# Altium project Common_AMC_Box.PrjPcb (part 1 of 6)
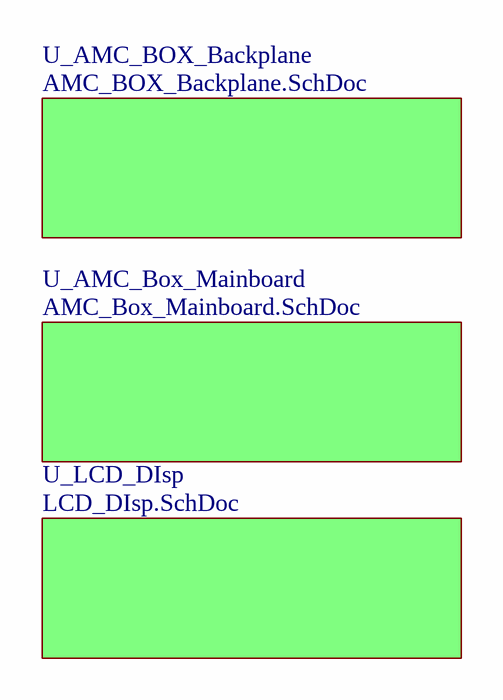
[diagram p0: Common_AMC_Box.SchDoc]
18 sheets, 545 parts. Net scope: flat (ports and power ports of the same name join across sheets).
Board file: Common_AMC_Box.PcbDoc
Sheets:
  Common_AMC_Box.SchDoc
    U_AMC_BOX_Backplane = AMC_BOX_Backplane.SchDoc
      AFC = AMC.SchDoc
    U_AMC_Box_Mainboard = AMC_Box_Mainboard.SchDoc
      U_Supply = Supply.SchDoc
      U_clocking = clocking.SchDoc
      U_IO = IO.SchDoc
      U_IO = IO.SchDoc
      U_SFP = SFP.SchDoc
      U_SFP = SFP.SchDoc
      U_I2C_SW = I2C_SW.SchDoc
      Thermal_MGT = Thermal_MGT.SchDoc
      U_CPU = CPU_ETH.SchDoc
      U_LCD = LCD.SchDoc
      U_USB_Hub_AMCbox = USB_Hub_AMCbox.SchDoc
      U_USB_UART = USB_UART.SchDoc
      U_JTAG_AMC_Box = JTAG_AMC_Box.SchDoc
      U_USB_I2C_Bridge = USB_I2C_Bridge.SchDoc
      U_QSFP0 = QSFP.SchDoc
      U_QSFP1 = QSFP.SchDoc
      U_QSFP2 = QSFP.SchDoc
    U_LCD_DIsp = LCD_DIsp.SchDoc

## Sheet Common_AMC_Box.SchDoc: Title
size 420 x 297 mm; Author: G.Kasprowicz; CompanyName: WUT ISE; DrawnBy: G.Kasprowicz; Organization: WUT ISE; Address1: PW ISE; Address2: Nowowiejska 15/19 00-665 Warsaw; Address3: gkasprow@gmail.com; DocumentNumber: 1; Revision: 2; SheetNumber: 1; SheetTotal: 18; ModifiedBy: -; CheckedDate: -; Title2: Title 2; DivGrp: WUT ISE; Designer: G.Kasprowicz; ModifiedDate: -; ProjectName: Sensor Box

### Sub-sheets
U_AMC_BOX_Backplane = AMC_BOX_Backplane.SchDoc: no entries
U_AMC_Box_Mainboard = AMC_Box_Mainboard.SchDoc: no entries
U_LCD_DIsp = LCD_DIsp.SchDoc: no entries

### Notes on the sheet
- Project/Equipment
- Document
- Designer
- Drawn by
- Check.by
- Copyright WUT ISE 2020.
  This documentation describes Open Hardware and is licensed under the CERN OHL v.1.2. You may redistribute and modify this documentation under the terms of the CERN OHL v.1.2. (http://ohwr.org/CERNOHL). This documentation is distributed WITHOUT ANY EXPRESS OR IMPLIED WARRANTY, INCLUDING OF MERCHANTABILITY, SATISFACTORY QUALITY AND FITNESS FOR A PARTICULAR PURPOSE. Please see the CERN OHL v.1.2 for applicable conditions.
- Contact
- File
- Last Mod.
- Print Date
- Sheet
- Size
- A3
- of
- Rev

## Sheet AMC_BOX_Backplane.SchDoc: Title
size 420 x 297 mm; Author: G.Kasprowicz; CompanyName: WUT ISE; DrawnBy: G.Kasprowicz; Organization: WUT ISE; Address1: PW ISE; Address2: Nowowiejska 15/19 00-665 Warsaw; Address3: gkasprow@gmail.com; DocumentNumber: 16; Revision: 2; SheetNumber: 16; SheetTotal: 18; ModifiedBy: -; CheckedDate: -; Title2: Title 2; DivGrp: WUT ISE; Designer: G.Kasprowicz; ModifiedDate: -; ProjectName: Sensor Box
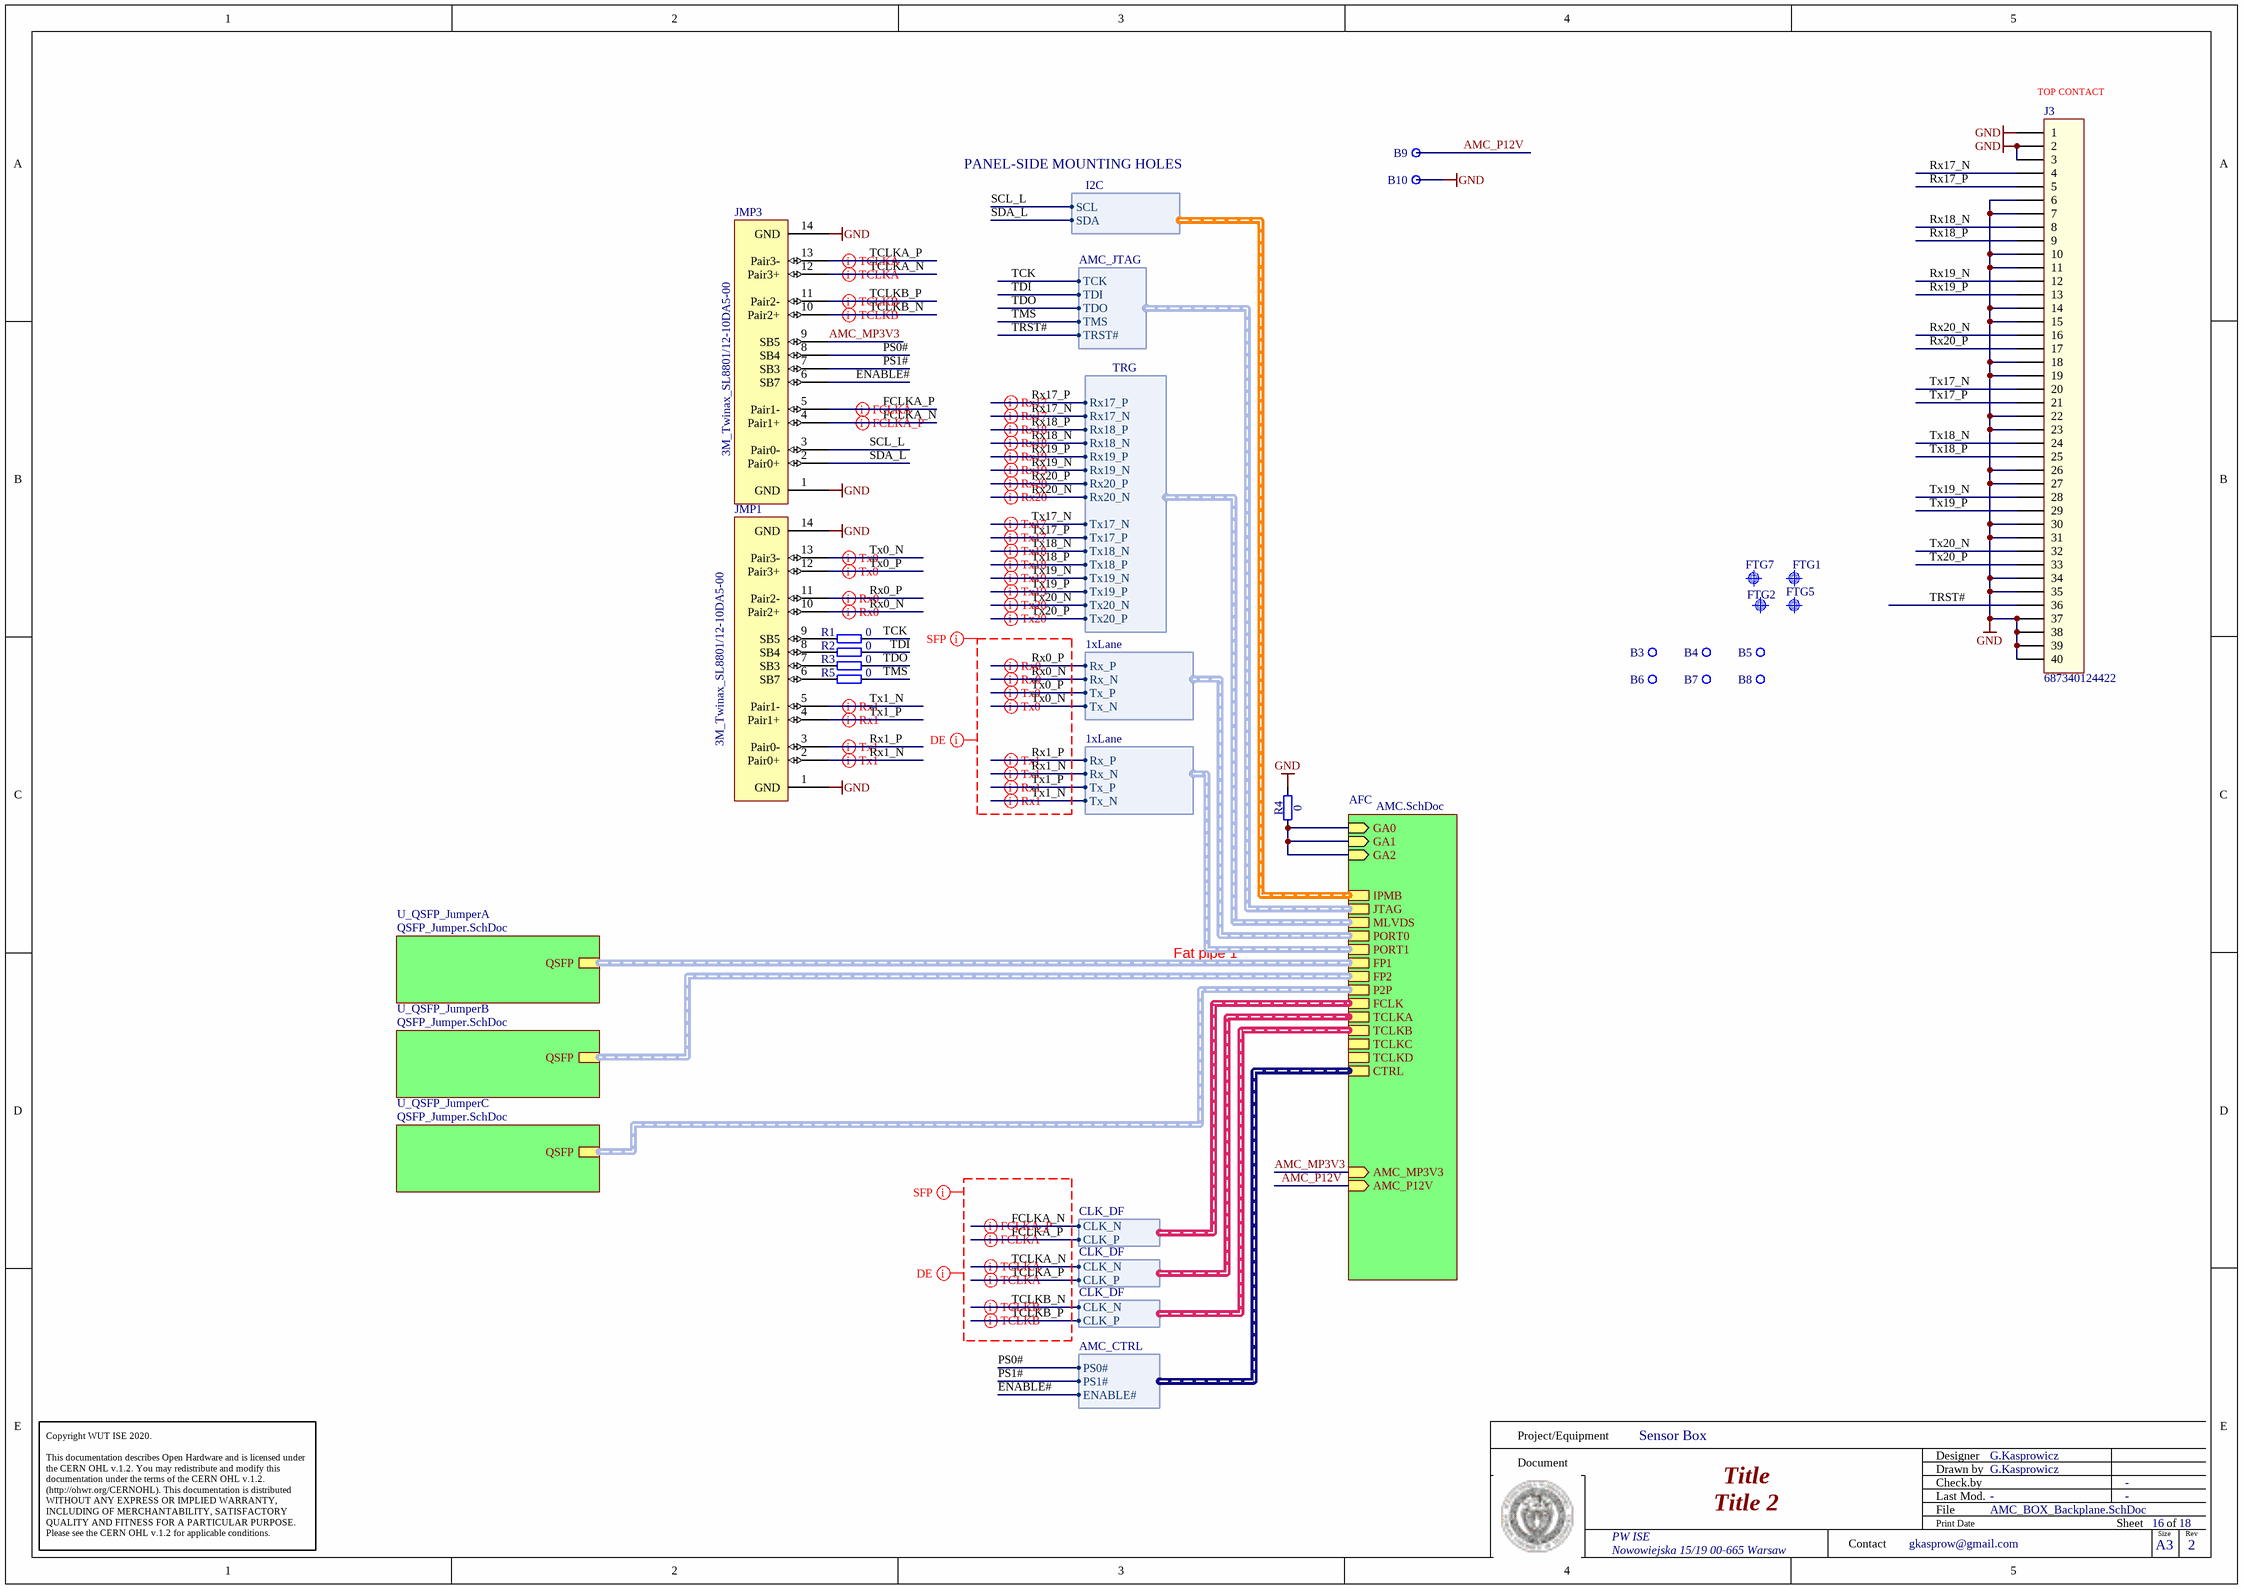
[diagram p1: AMC_BOX_Backplane.SchDoc]

### Parts
(Parts that share a designator on the sheet are numbered #1, #2 ... from top to bottom, then left to right.)
B3  Plated Hole  [MTG320_550]  (value not drawn)
B4  Plated Hole  [MTG320_550]  (value not drawn)
B5  Plated Hole  [MTG320_550]  (value not drawn)
B6  Plated Hole  [MTG320_550]  (value not drawn)
B7  Plated Hole  [MTG320_550]  (value not drawn)
B8  Plated Hole  [MTG320_550]  (value not drawn)
B9  Plated Hole  [c200h150]  (value not drawn)
B10  Plated Hole  [c200h150]  (value not drawn)
FTG1  Use only in PCB  [FIDUCIAL_TOP_S100-200]  (value not drawn)
FTG2  Use only in PCB  [FIDUCIAL_TOP_S100-200]  (value not drawn)
FTG5  Use only in PCB  [FIDUCIAL_TOP_S100-200]  (value not drawn)
FTG7  Use only in PCB  [FIDUCIAL_TOP_S100-200]  (value not drawn)
J3  687340124422  [687340124422]
JMP1  3M_Twinax_SL8801/12-10DA5-00  [3M_Twinax_SL8801/12-10DA5-00]
JMP3  3M_Twinax_SL8801/12-10DA5-00  [3M_Twinax_SL8801/12-10DA5-00]
R1#1  0  [RESC1005X40N]
R2#1  0  [RESC1005X40N]
R3#1  0  [RESC1005X40N]
R4#1  0  [RESC1005X40N]
R5#1  0  [RESC1005X40N]

### Sub-sheets
AFC = AMC.SchDoc: GA0 (in), GA1 (in), GA2 (in), MLVDS (harness TRG), PORT0 (harness 1xLane), FP2 (harness FP), PORT1 (harness 1xLane), FCLK (harness CLK_DF), TCLKA (harness CLK_DF), TCLKB (harness CLK_DF), TCLKC (harness CLK_DF), TCLKD (harness CLK_DF), FP1 (harness QSFP), AMC_P12V (in), AMC_MP3V3 (in), IPMB (harness I2C), CTRL (harness AMC_CTRL), P2P (harness FP), JTAG (harness AMC_JTAG)
U_QSFP_JumperA = QSFP_Jumper.SchDoc (file not in this document): QSFP (harness QSFP)
U_QSFP_JumperB = QSFP_Jumper.SchDoc (file not in this document): QSFP (harness QSFP)
U_QSFP_JumperC = QSFP_Jumper.SchDoc (file not in this document): QSFP (harness QSFP)

### Harnesses
I2C: SCL, SDA
1xLane: Rx_P, Rx_N, Tx_P, Tx_N
CLK_DF: CLK_P, CLK_N
AMC_CTRL: PS0#, PS1#, ENABLE#
TRG: Rx17_P, Rx17_N, Rx18_P, Rx18_N, Rx19_P, Rx19_N, Rx20_P, Rx20_N, Tx17_N, Tx17_P, Tx18_N, Tx18_P, Tx19_N, Tx19_P, Tx20_N, Tx20_P
AMC_JTAG: TCK, TDI, TDO, TMS, TRST#

### Nets
GND: B10.1 J3.1 J3.2 J3.3 J3.6 J3.7 J3.10 J3.11 J3.14 J3.15 J3.18 J3.19 J3.22 J3.23 J3.26 J3.27 J3.30 J3.31 J3.34 J3.35 J3.37 J3.38 J3.39 J3.40 JMP1.1(GND) JMP1.14(GND) JMP3.1(GND) JMP3.14(GND) R4#1.2
AMC_MP3V3: JMP3.9(SB5) ; sheet AFC/AMC_MP3V3
AMC_P12V: B9.1 ; sheet AFC/AMC_P12V
ENABLE#: JMP3.6(SB7) ; sheet AFC/CTRL.ENABLE#
FCLKA_N: JMP3.4(Pair1+) ; sheet AFC/FCLK.CLK_N
FCLKA_P: JMP3.5(Pair1-) ; sheet AFC/FCLK.CLK_P
PS0#: JMP3.8(SB4) ; sheet AFC/CTRL.PS0#
PS1#: JMP3.7(SB3) ; sheet AFC/CTRL.PS1#
Rx0_N: JMP1.10(Pair2+) ; sheet AFC/PORT0.Rx_N
Rx0_P: JMP1.11(Pair2-) ; sheet AFC/PORT0.Rx_P
Rx1_N: JMP1.2(Pair0+) ; sheet AFC/PORT1.Rx_N
Rx1_P: JMP1.3(Pair0-) ; sheet AFC/PORT1.Rx_P
Rx17_N: J3.4 ; sheet AFC/MLVDS.Rx17_N
Rx17_P: J3.5 ; sheet AFC/MLVDS.Rx17_P
Rx18_N: J3.8 ; sheet AFC/MLVDS.Rx18_N
Rx18_P: J3.9 ; sheet AFC/MLVDS.Rx18_P
Rx19_N: J3.12 ; sheet AFC/MLVDS.Rx19_N
Rx19_P: J3.13 ; sheet AFC/MLVDS.Rx19_P
Rx20_N: J3.16 ; sheet AFC/MLVDS.Rx20_N
Rx20_P: J3.17 ; sheet AFC/MLVDS.Rx20_P
SCL_L: JMP3.3(Pair0-) ; sheet AFC/IPMB.SCL
SDA_L: JMP3.2(Pair0+) ; sheet AFC/IPMB.SDA
TCK: R1#1.2 ; sheet AFC/JTAG.TCK
TCLKA_N: JMP3.12(Pair3+) ; sheet AFC/TCLKA.CLK_N
TCLKA_P: JMP3.13(Pair3-) ; sheet AFC/TCLKA.CLK_P
TCLKB_N: JMP3.10(Pair2+) ; sheet AFC/TCLKB.CLK_N
TCLKB_P: JMP3.11(Pair2-) ; sheet AFC/TCLKB.CLK_P
TDI: R2#1.2 ; sheet AFC/JTAG.TDI
TDO: R3#1.2 ; sheet AFC/JTAG.TDO
TMS: R5#1.2 ; sheet AFC/JTAG.TMS
TRST#: J3.36 ; sheet AFC/JTAG.TRST#
Tx0_N: JMP1.13(Pair3-) ; sheet AFC/PORT0.Tx_N
Tx0_P: JMP1.12(Pair3+) ; sheet AFC/PORT0.Tx_P
Tx1_N: JMP1.5(Pair1-) ; sheet AFC/PORT1.Tx_N
Tx1_P: JMP1.4(Pair1+) ; sheet AFC/PORT1.Tx_P
Tx17_N: J3.20 ; sheet AFC/MLVDS.Tx17_N
Tx17_P: J3.21 ; sheet AFC/MLVDS.Tx17_P
Tx18_N: J3.24 ; sheet AFC/MLVDS.Tx18_N
Tx18_P: J3.25 ; sheet AFC/MLVDS.Tx18_P
Tx19_N: J3.28 ; sheet AFC/MLVDS.Tx19_N
Tx19_P: J3.29 ; sheet AFC/MLVDS.Tx19_P
Tx20_N: J3.32 ; sheet AFC/MLVDS.Tx20_N
Tx20_P: J3.33 ; sheet AFC/MLVDS.Tx20_P
NetJMP1_6: JMP1.6(SB7) R5#1.1
NetJMP1_7: JMP1.7(SB3) R3#1.1
NetJMP1_8: JMP1.8(SB4) R2#1.1
NetJMP1_9: JMP1.9(SB5) R1#1.1
NetR4#1_1: R4#1.1 ; sheet AFC/GA0, sheet AFC/GA1, sheet AFC/GA2

Not connected (* = marked no-connect by the designer): B3 1; B4 1; B5 1; B6 1; B7 1; B8 1

### Buses and harness runs
harness sheet AFC/FP1 = sheet U_QSFP_JumperA/QSFP
harness sheet AFC/FP2 = sheet U_QSFP_JumperB/QSFP
harness sheet AFC/P2P = sheet U_QSFP_JumperC/QSFP

### Layout directives
differential pair: FCLKA_N, FCLKA_P, Rx0_N, Rx0_P, Rx1_N, Rx1_P, Rx17_N, Rx17_P, Rx18_N, Rx18_P, Rx19_N, Rx19_P, Rx20_N, Rx20_P, TCLKA_N, TCLKA_P, TCLKB_N, TCLKB_P, Tx0_N, Tx0_P, Tx1_N, Tx1_P, Tx17_N, Tx17_P, Tx18_N, Tx18_P, Tx19_N, Tx19_P, Tx20_N, Tx20_P
net class SFP: FCLKA_N, FCLKA_P, Rx0_N, Rx0_P, Rx1_N, Rx1_P, TCLKA_N, TCLKA_P, TCLKB_N, TCLKB_P, Tx0_N, Tx0_P, Tx1_N, Tx1_P
net class DE: FCLKA_N, FCLKA_P, Rx0_N, Rx0_P, Rx1_N, Rx1_P, TCLKA_N, TCLKA_P, TCLKB_N, TCLKB_P, Tx0_N, Tx0_P, Tx1_N, Tx1_P

### Notes on the sheet
- (near J3) TOP CONTACT
- PANEL-SIDE MOUNTING HOLES
- Fat pipe 1
- Project/Equipment
- Document
- Designer
- Drawn by
- Check.by
- Copyright WUT ISE 2020.
  This documentation describes Open Hardware and is licensed under the CERN OHL v.1.2. You may redistribute and modify this documentation under the terms of the CERN OHL v.1.2. (http://ohwr.org/CERNOHL). This documentation is distributed WITHOUT ANY EXPRESS OR IMPLIED WARRANTY, INCLUDING OF MERCHANTABILITY, SATISFACTORY QUALITY AND FITNESS FOR A PARTICULAR PURPOSE. Please see the CERN OHL v.1.2 for applicable conditions.
- Contact
- File
- Last Mod.
- Print Date
- Sheet
- Size
- A3
- of
- Rev

### Library data of the parts
B3-B8 = PLATED_HOLE3.2_PAD5.5: Single Terminal Socket; Part Description: Plated Through Hole: Hole Dia.=3.2mm Pad Dia.=5.5mm; Mounted: No; Part Number: PLATED_HOLE3.2_PAD5.5; Component Kind: Standard (No BOM); Component Type: Standard (No BOM); Pin Count: 1; Family: Plated Hole; Socket: No; SMD: No; Sense: No; Status: None; ComponentHeight: 0mm; HelpURL: Undefined; Author: CERN DEM JMW; CreateDate: 01.10.2012; LatestRevisionDate: 01.10.2012; PackageDescription: Plated Through Hole: Hole Dia.=3.2mm Pad Dia.=5.5mm
B9 B10 = PLATED_HOLE1.5_PAD2.0: Single Terminal Socket; Part Description: Plated Through Hole: Hole Dia.=1.5mm Pad Dia.=2.0mm, IPC-7251 Level C; Mounted: No; Part Number: PLATED_HOLE1.5_PAD2.0; Component Kind: Standard (No BOM); Component Type: Standard (No BOM); Pin Count: 1; Family: Plated Hole; Socket: No; SMD: No; Sense: No; Status: None; ComponentHeight: 0mm; HelpURL: Undefined; Author: CERN DEM JLC; CreateDate: 30.10.2008; LatestRevisionDate: 30.10.2008; PackageDescription: Plated Through Hole: Hole Dia.=1.5mm Pad Dia.=2.0mm, IPC-7251 Level C
FTG1 FTG2 FTG5 FTG7 = FIDUCIAL_TARGET_S100-200: Fiducial Target; Part Description: Square Fiducial Target, Top Layer, 1.0mm, Top Solder 2.0mm, Keepout =2.0mm; Mounted: No; Table: Pads; Part Number: FIDUCIAL_TARGET_S100-200; Component Kind: Standard (No BOM); Component Type: Standard (No BOM); Pin Count: 1; Family: Fiducial; Socket: No; SMD: Yes; Status: None; ComponentHeight: 0mm; Author: CERN DEM JLC; CreateDate: 2010-02-09; LatestRevisionDate: 2012-04-04; PackageDescription: Square Fiducial Target, Top Layer, 1.0mm, Top Solder 2.0mm, Keepout =2.0mm
J3 = 687340124422: 0.50 mm SMT ZIF Vertical WR-FPC, 40 pins; Pitch: 0.5 mm; Pin Number: 40; ComponentLink1Description: Manufacturer; ComponentLink1URL: http://www.we-online.de; ComponentLink2Description: Datasheet; ComponentLink2URL: http://katalog.we-online.com/em/datasheet/6873xx124422.pdf; Part Number: 687340124422; Published Date: April 2017; Publisher: Wurth Elektronik
JMP1 JMP3 = CBL_TWINAX_3M_4pairs_SB: Flat Ribbon Cable Silver 8 (4 Pair) Conductors 0.093" (2.37mm) Between Pairs Flat Twin Axial 500.0' (152.40m)
R1#1 R2#1 R3#1 R4#1 R5#1 = R0402_0R_JUMPER: Resistor; Part Description: 1A (0.05R Max DC Resistance) Zero Ohm Jumper; Manufacturer: GENERIC; Manufacturer1 Part Number: 232270591001L; Table: Resistors SMD; Part Number: R0402_0R_JUMPER; Component Kind: Standard; Component Type: Standard; Pin Count: 2; Value: 0; Status: Not recommended; Manufacturer Part Number: R0402_0R_JUMPER; Case: 0402; Mounted: Yes; Socket: No; SMD: Yes; Manufacturer1 Example: YAGEO PHYCOMP; Manufacturer1 ComponentHeight: 0.4mm; HelpURL: \\cern.ch\dfs\Applications\Altium\Datasheets\R0402_Phycomp_RC0402.pdf; Author: CERN DEM JLC; CreateDate: 2007-12-03; LatestRevisionDate: 2012-10-17

## Sheet AMC.SchDoc: Title
size 420 x 297 mm; Author: G.Kasprowicz; CompanyName: WUT ISE; DrawnBy: G.Kasprowicz; Organization: WUT ISE; Address1: PW ISE; Address2: Nowowiejska 15/19 00-665 Warsaw; Address3: gkasprow@gmail.com; DocumentNumber: 17; Revision: 2; SheetNumber: 17; SheetTotal: 18; ModifiedBy: -; CheckedDate: -; Title2: Title 2; DivGrp: WUT ISE; Designer: G.Kasprowicz; ModifiedDate: -; ProjectName: Sensor Box
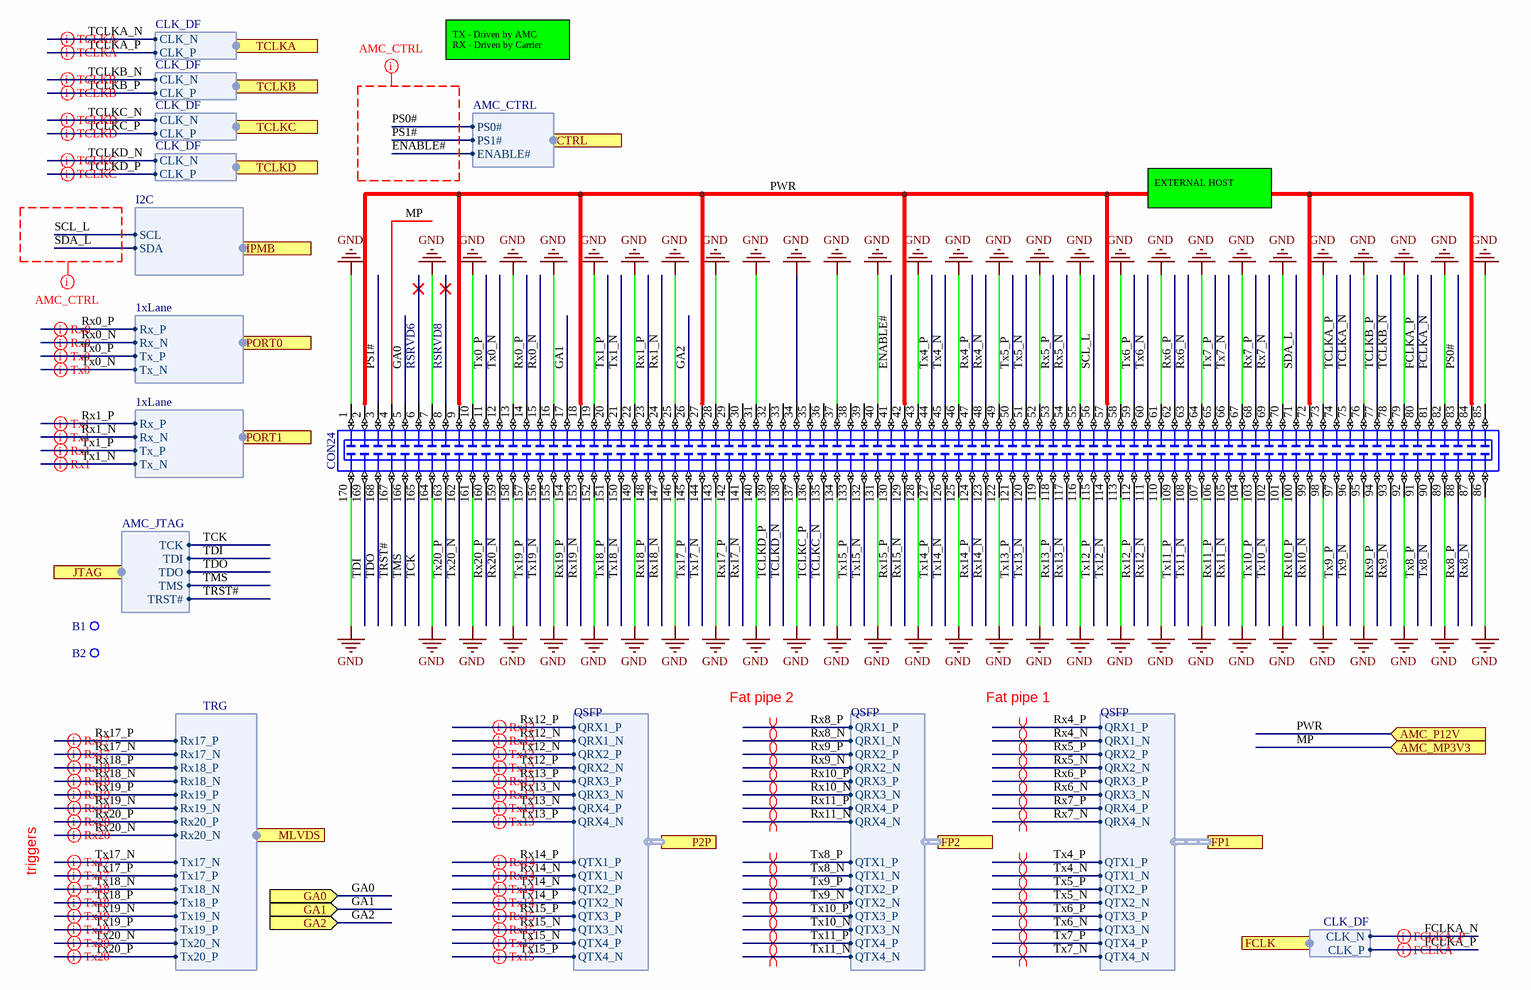
[diagram p2: AMC.SchDoc]

### Parts
B1  Plated Hole  [MTG320_550]  (value not drawn)
B2  Plated Hole  [MTG320_550]  (value not drawn)
CON24  SAMTEC_MTCA-085-02-S-DV-SMT-K-TR  [SAMTEC_MTCA-085-02-S-DV-SMT-K-TR]  (value not drawn)

### Ports
AMC_MP3V3 (in), AMC_P12V (in), CTRL (harness AMC_CTRL), FCLK (harness CLK_DF), FP1 (harness QSFP), FP2 (harness QSFP), GA0 (in), GA1 (in), GA2 (in), IPMB (harness I2C), JTAG (harness AMC_JTAG), MLVDS (harness TRG), P2P (harness QSFP), PORT0 (harness 1xLane), PORT1 (harness 1xLane), TCLKA (harness CLK_DF), TCLKB (harness CLK_DF), TCLKC (harness CLK_DF), TCLKD (harness CLK_DF)

### Harnesses
TRG: Rx17_P, Rx17_N, Rx18_P, Rx18_N, Rx19_P, Rx19_N, Rx20_P, Rx20_N, Tx17_N, Tx17_P, Tx18_N, Tx18_P, Tx19_N, Tx19_P, Tx20_N, Tx20_P
1xLane: Rx_P, Rx_N, Tx_P, Tx_N
I2C: SCL, SDA
CLK_DF: CLK_P, CLK_N
AMC_CTRL: PS0#, PS1#, ENABLE#
AMC_JTAG: TCK, TDI, TDO, TMS, TRST#
QSFP: QRX1_P, QRX1_N, QRX2_P, QRX2_N, QRX3_P, QRX3_N, QRX4_P, QRX4_N, QTX1_P, QTX1_N, QTX2_P, QTX2_N, QTX3_P, QTX3_N, QTX4_P, QTX4_N

### Nets
GND: CON24.1 CON24.7 CON24.10 CON24.13 CON24.16 CON24.19 CON24.22 CON24.25 CON24.28 CON24.31 CON24.34 CON24.37 CON24.40 CON24.43 CON24.46 CON24.49 CON24.52 CON24.55 CON24.58 CON24.61 CON24.64 CON24.67 CON24.70 CON24.73 CON24.76 CON24.79 CON24.82 CON24.85 CON24.86 CON24.89 CON24.92 CON24.95 CON24.98 CON24.101 CON24.104 CON24.107 CON24.110 CON24.113 CON24.116 CON24.119 CON24.122 CON24.125 CON24.128 CON24.131 CON24.134 CON24.137 CON24.140 CON24.143 CON24.146 CON24.149 CON24.152 CON24.155 CON24.158 CON24.161 CON24.164 CON24.170
ENABLE#: CON24.41 ; port CTRL.ENABLE#
FCLKA_N: CON24.81 ; port FCLK.CLK_N
FCLKA_P: CON24.80 ; port FCLK.CLK_P
GA0: CON24.5 ; port GA0
GA1: CON24.17 ; port GA1
GA2: CON24.26 ; port GA2
MP: CON24.4 ; port AMC_MP3V3
PS0#: CON24.83 ; port CTRL.PS0#
PS1#: CON24.3 ; port CTRL.PS1#
PWR: CON24.2 CON24.9 CON24.18 CON24.27 CON24.42 CON24.57 CON24.72 CON24.84 ; port AMC_P12V
Rx0_N: CON24.15 ; port PORT0.Rx_N
Rx0_P: CON24.14 ; port PORT0.Rx_P
Rx1_N: CON24.24 ; port PORT1.Rx_N
Rx1_P: CON24.23 ; port PORT1.Rx_P
Rx4_N: CON24.48 ; port FP1.QRX1_N
Rx4_P: CON24.47 ; port FP1.QRX1_P
Rx5_N: CON24.54 ; port FP1.QRX2_N
Rx5_P: CON24.53 ; port FP1.QRX2_P
Rx6_N: CON24.63 ; port FP1.QRX3_N
Rx6_P: CON24.62 ; port FP1.QRX3_P
Rx7_N: CON24.69 ; port FP1.QRX4_N
Rx7_P: CON24.68 ; port FP1.QRX4_P
Rx8_N: CON24.87 ; port FP2.QRX1_N
Rx8_P: CON24.88 ; port FP2.QRX1_P
Rx9_N: CON24.93 ; port FP2.QRX2_N
Rx9_P: CON24.94 ; port FP2.QRX2_P
Rx10_N: CON24.99 ; port FP2.QRX3_N
Rx10_P: CON24.100 ; port FP2.QRX3_P
Rx11_N: CON24.105 ; port FP2.QRX4_N
Rx11_P: CON24.106 ; port FP2.QRX4_P
Rx12_N: CON24.111 ; port P2P.QRX1_N
Rx12_P: CON24.112 ; port P2P.QRX1_P
Rx13_N: CON24.117 ; port P2P.QRX3_N
Rx13_P: CON24.118 ; port P2P.QRX3_P
Rx14_N: CON24.123 ; port P2P.QTX1_N
Rx14_P: CON24.124 ; port P2P.QTX1_P
Rx15_N: CON24.129 ; port P2P.QTX3_N
Rx15_P: CON24.130 ; port P2P.QTX3_P
Rx17_N: CON24.141 ; port MLVDS.Rx17_N
Rx17_P: CON24.142 ; port MLVDS.Rx17_P
Rx18_N: CON24.147 ; port MLVDS.Rx18_N
Rx18_P: CON24.148 ; port MLVDS.Rx18_P
Rx19_N: CON24.153 ; port MLVDS.Rx19_N
Rx19_P: CON24.154 ; port MLVDS.Rx19_P
Rx20_N: CON24.159 ; port MLVDS.Rx20_N
Rx20_P: CON24.160 ; port MLVDS.Rx20_P
SCL_L: CON24.56 ; port IPMB.SCL
SDA_L: CON24.71 ; port IPMB.SDA
TCK: CON24.165 ; port JTAG.TCK
TCLKA_N: CON24.75 ; port TCLKA.CLK_N
TCLKA_P: CON24.74 ; port TCLKA.CLK_P
TCLKB_N: CON24.78 ; port TCLKB.CLK_N
TCLKB_P: CON24.77 ; port TCLKB.CLK_P
TCLKC_N: CON24.135 ; port TCLKC.CLK_N
TCLKC_P: CON24.136 ; port TCLKC.CLK_P
TCLKD_N: CON24.138 ; port TCLKD.CLK_N
TCLKD_P: CON24.139 ; port TCLKD.CLK_P
TDI: CON24.169 ; port JTAG.TDI
TDO: CON24.168 ; port JTAG.TDO
TMS: CON24.166 ; port JTAG.TMS
TRST#: CON24.167 ; port JTAG.TRST#
Tx0_N: CON24.12 ; port PORT0.Tx_N
Tx0_P: CON24.11 ; port PORT0.Tx_P
Tx1_N: CON24.21 ; port PORT1.Tx_N
Tx1_P: CON24.20 ; port PORT1.Tx_P
Tx4_N: CON24.45 ; port FP1.QTX1_N
Tx4_P: CON24.44 ; port FP1.QTX1_P
Tx5_N: CON24.51 ; port FP1.QTX2_N
Tx5_P: CON24.50 ; port FP1.QTX2_P
Tx6_N: CON24.60 ; port FP1.QTX3_N
Tx6_P: CON24.59 ; port FP1.QTX3_P
Tx7_N: CON24.66 ; port FP1.QTX4_N
Tx7_P: CON24.65 ; port FP1.QTX4_P
Tx8_N: CON24.90 ; port FP2.QTX1_N
Tx8_P: CON24.91 ; port FP2.QTX1_P
Tx9_N: CON24.96 ; port FP2.QTX2_N
Tx9_P: CON24.97 ; port FP2.QTX2_P
Tx10_N: CON24.102 ; port FP2.QTX3_N
Tx10_P: CON24.103 ; port FP2.QTX3_P
Tx11_N: CON24.108 ; port FP2.QTX4_N
Tx11_P: CON24.109 ; port FP2.QTX4_P
Tx12_N: CON24.114 ; port P2P.QRX2_P
Tx12_P: CON24.115 ; port P2P.QRX2_N
Tx13_N: CON24.120 ; port P2P.QRX4_P
Tx13_P: CON24.121 ; port P2P.QRX4_N
Tx14_N: CON24.126 ; port P2P.QTX2_P
Tx14_P: CON24.127 ; port P2P.QTX2_N
Tx15_N: CON24.132 ; port P2P.QTX4_P
Tx15_P: CON24.133 ; port P2P.QTX4_N
Tx17_N: CON24.144 ; port MLVDS.Tx17_N
Tx17_P: CON24.145 ; port MLVDS.Tx17_P
Tx18_N: CON24.150 ; port MLVDS.Tx18_N
Tx18_P: CON24.151 ; port MLVDS.Tx18_P
Tx19_N: CON24.156 ; port MLVDS.Tx19_N
Tx19_P: CON24.157 ; port MLVDS.Tx19_P
Tx20_N: CON24.162 ; port MLVDS.Tx20_N
Tx20_P: CON24.163 ; port MLVDS.Tx20_P

Not connected (* = marked no-connect by the designer): B1 1; B2 1; CON24 6* 8* 29 30 32 33 35 36 38 39

### Layout directives
differential pair: FCLKA_N, FCLKA_P, Rx0_N, Rx0_P, Rx1_N, Rx1_P, Rx4_N, Rx4_P, Rx5_N, Rx5_P, Rx6_N, Rx6_P, Rx7_N, Rx7_P, Rx8_N, Rx8_P, Rx9_N, Rx9_P, Rx10_N, Rx10_P, Rx11_N, Rx11_P, Rx12_N, Rx12_P, Rx13_N, Rx13_P, Rx14_N, Rx14_P, Rx15_N, Rx15_P, Rx17_N, Rx17_P, Rx18_N, Rx18_P, Rx19_N, Rx19_P, Rx20_N, Rx20_P, TCLKA_N, TCLKA_P, TCLKB_N, TCLKB_P, TCLKC_N, TCLKC_P, TCLKD_N, TCLKD_P, Tx0_N, Tx0_P, Tx1_N, Tx1_P, Tx4_N, Tx4_P, Tx5_N, Tx5_P, Tx6_N, Tx6_P, Tx7_N, Tx7_P, Tx8_N, Tx8_P, Tx9_N, Tx9_P, Tx10_N, Tx10_P, Tx11_N, Tx11_P, Tx12_N, Tx12_P, Tx13_N, Tx13_P, Tx14_N, Tx14_P, Tx15_N, Tx15_P, Tx17_N, Tx17_P, Tx18_N, Tx18_P, Tx19_N, Tx19_P, Tx20_N, Tx20_P
net class AMC_CTRL: ENABLE#, PS0#, PS1#, SCL_L, SDA_L

### Notes on the sheet
- TX - Driven by AMC
  RX - Driven by Carrier
- EXTERNAL HOST
- RSRVD6
- RSRVD8
- Fat pipe 2
- Fat pipe 1
- triggers
- Project/Equipment
- Document
- Designer
- Drawn by
- Check.by
- Copyright WUT ISE 2020.
  This documentation describes Open Hardware and is licensed under the CERN OHL v.1.2. You may redistribute and modify this documentation under the terms of the CERN OHL v.1.2. (http://ohwr.org/CERNOHL). This documentation is distributed WITHOUT ANY EXPRESS OR IMPLIED WARRANTY, INCLUDING OF MERCHANTABILITY, SATISFACTORY QUALITY AND FITNESS FOR A PARTICULAR PURPOSE. Please see the CERN OHL v.1.2 for applicable conditions.
- Contact
- File
- Last Mod.
- Print Date
- Sheet
- Size
- A3
- of
- Rev

### Library data of the parts
B1 B2 = PLATED_HOLE3.2_PAD5.5: as B3 on sheet AMC_BOX_Backplane; Part Number: PLATED_HOLE3.2_PAD5.5; Component Kind: Standard (No BOM); Component Type: Standard (No BOM); Pin Count: 1; Family: Plated Hole; Socket: No; SMD: No; Sense: No; Status: None; ComponentHeight: 0mm; HelpURL: Undefined; Author: CERN DEM JMW; CreateDate: 01.10.2012; LatestRevisionDate: 01.10.2012; PackageDescription: Plated Through Hole: Hole Dia.=3.2mm Pad Dia.=5.5mm
CON24 = SAMTEC_MTCA-085-02-S-DV-SMT-K-TR: 170 Poles,  Micro TCA (Telecom Computing Architecture) Edge Card Socket; Part Description: 170 Poles, Pitch 0.75mm, Micro TCA (Telecom Computing Architecture) Edge Card Socket; Manufacturer: SAMTEC; Part Number: SAMTEC_MTCA-085-02-S-DV-SMT-K-TR; Component Kind: Standard; Component Type: Standard; Pin Count: 170; Mounted: Yes; Socket: No; SMD: Yes; Status: None; Manufacturer Part Number: MTCA-085-02-S-DV-SMT-K-TR; ComponentHeight: 12.85mm; HelpURL: \\cern.ch\dfs\Applications\Altium\Datasheets\SAMTEC_MTCA-085-02-S-DV-SMT-K-TR.pdf; Author: CERN DEM JLC; CreateDate: 2012-08-15; LatestRevisionDate: 2012-08-15; Table: SAMTEC

## Sheet AMC_Box_Mainboard.SchDoc: AMC Box
size 420 x 297 mm; Author: G.Kasprowicz; CompanyName: WUT ISE; DrawnBy: G.Kasprowicz; Organization: WUT ISE; Address1: PW ISE; Address2: Nowowiejska 15/19 00-665 Warsaw; Address3: gkasprow@gmail.com; DocumentNumber: 2; Revision: 2; SheetNumber: 2; SheetTotal: 18; ModifiedBy: -; CheckedDate: -; Title2: Title 2; DivGrp: WUT ISE; Designer: G.Kasprowicz; ModifiedDate: -; ProjectName: Sensor Box
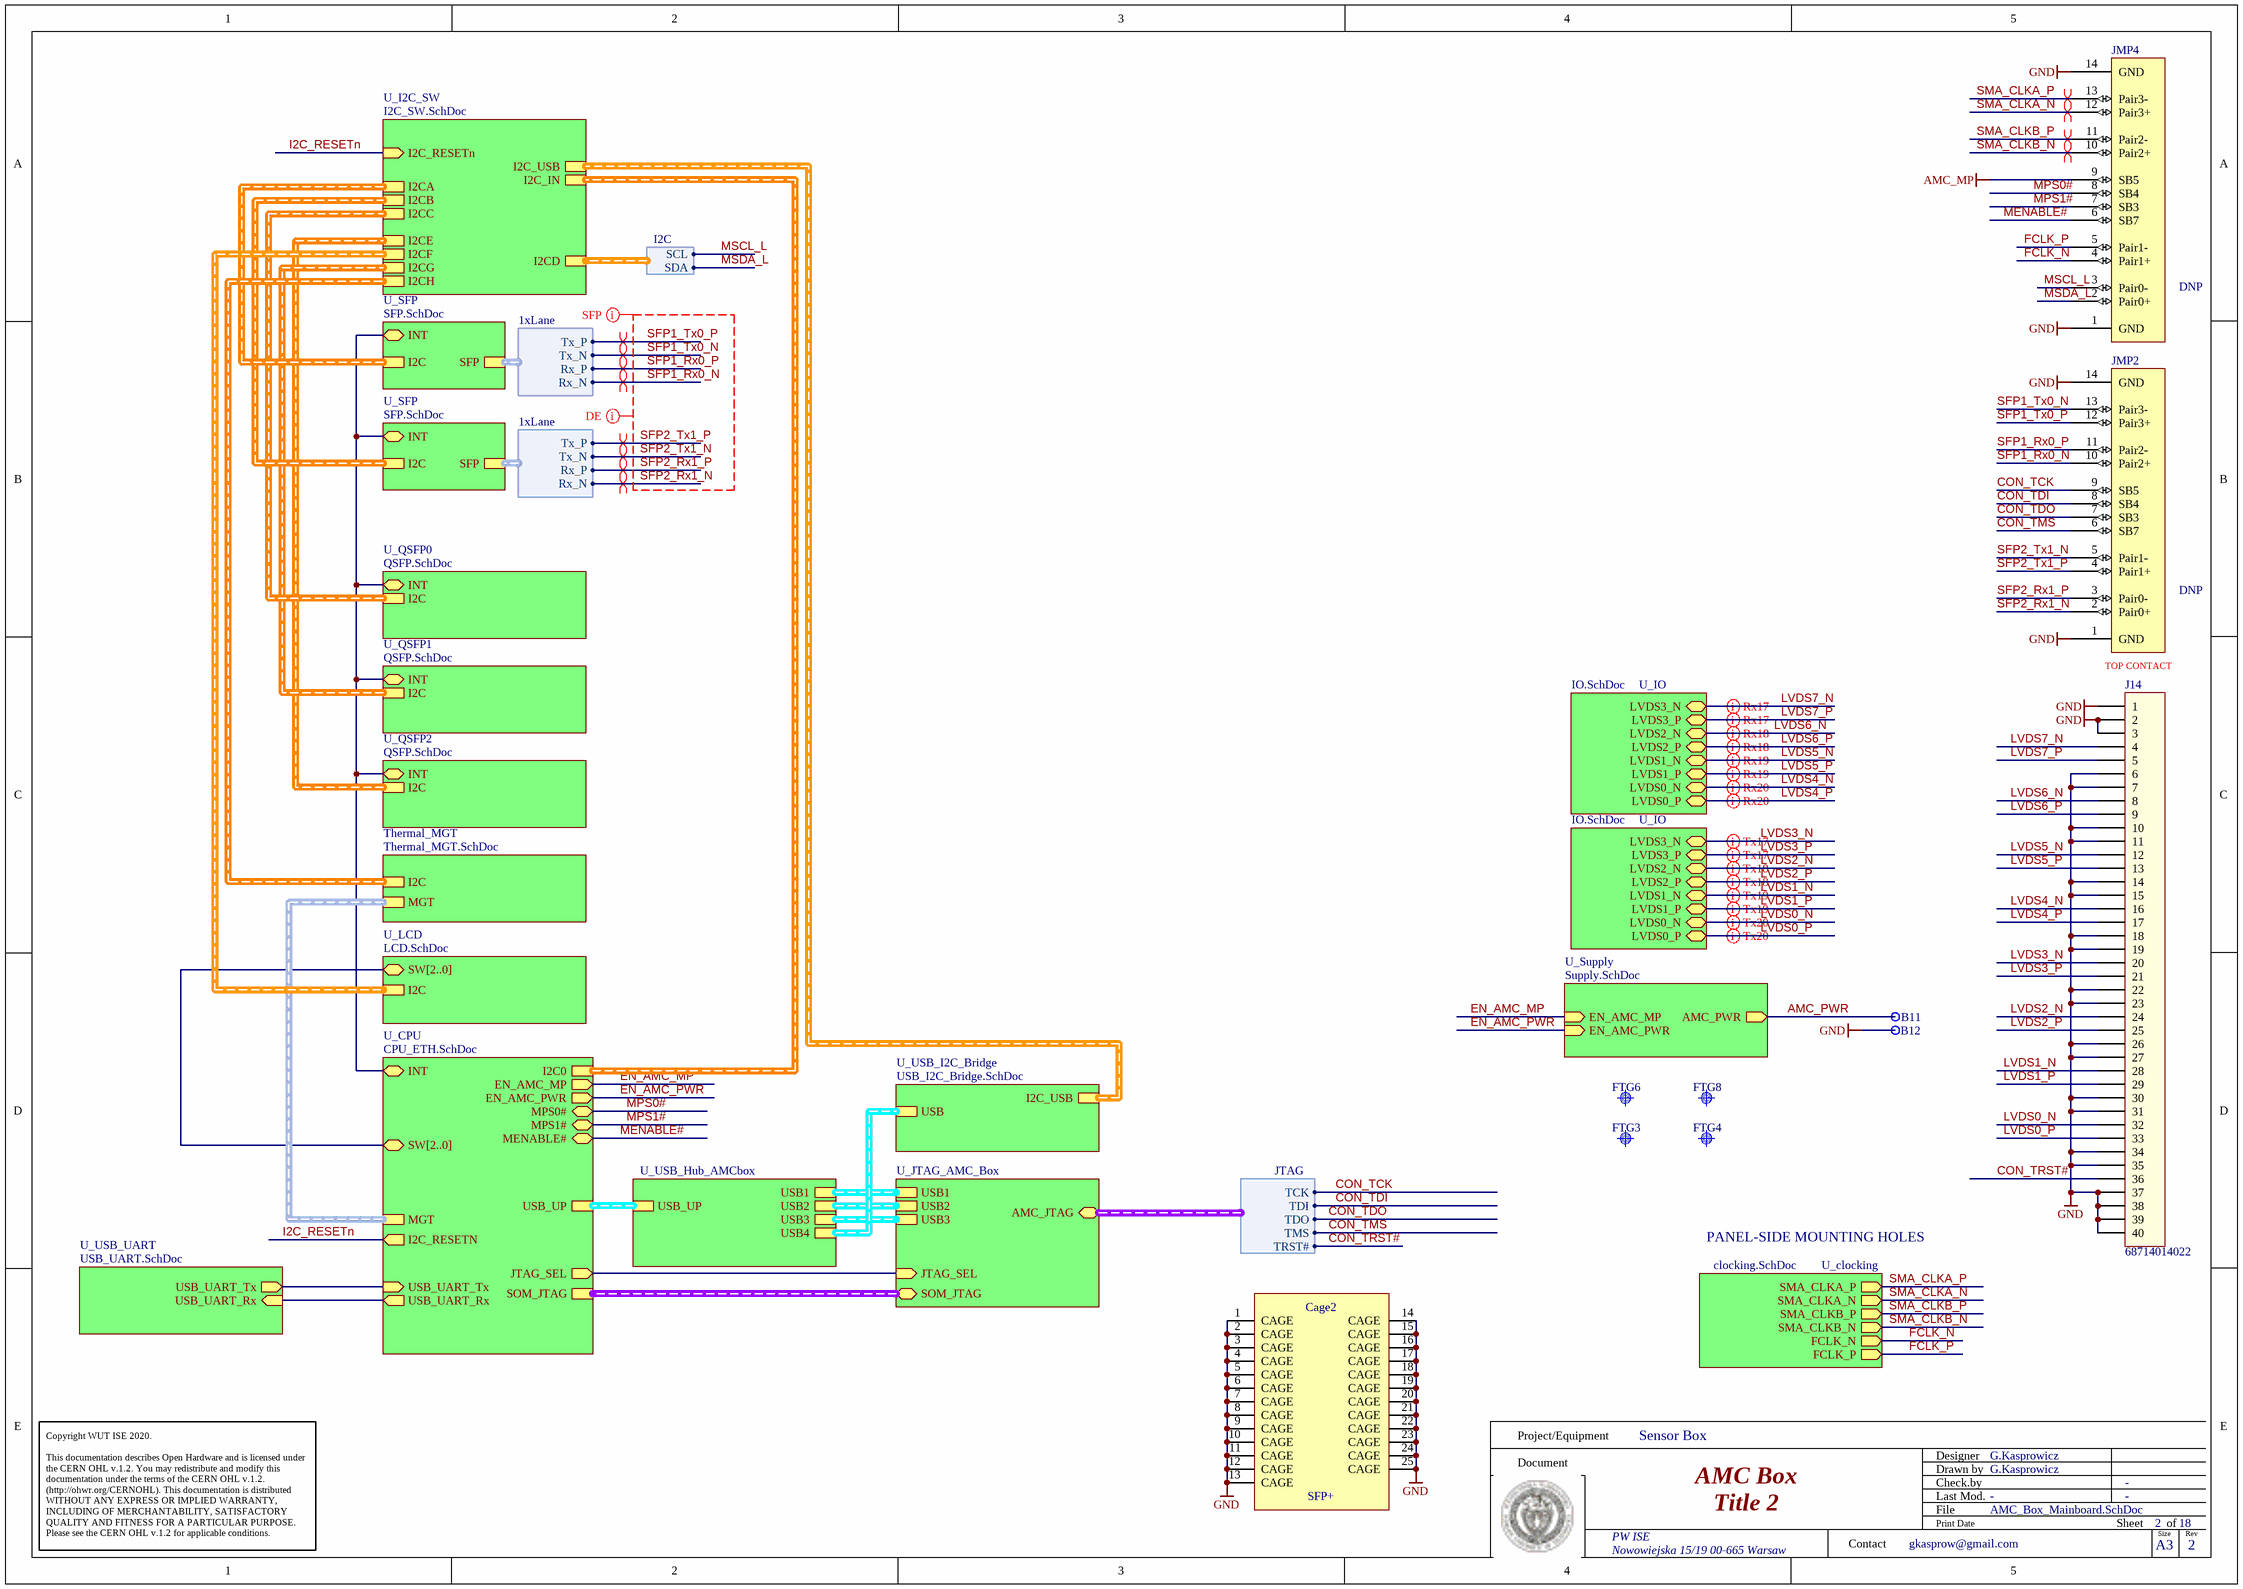
[diagram p3: AMC_Box_Mainboard.SchDoc]

### Parts
B11  Plated Hole  [c200h150]  (value not drawn)
B12  Plated Hole  [c200h150]  (value not drawn)
Cage2  SFP+  [TYCO_2007263-1]
FTG3  Use only in PCB  [FIDUCIAL_TOP_S100-200]  (value not drawn)
FTG4  Use only in PCB  [FIDUCIAL_TOP_C100-200]  (value not drawn)
FTG6  Use only in PCB  [FIDUCIAL_TOP_S100-200]  (value not drawn)
FTG8  Use only in PCB  [FIDUCIAL_TOP_C100-200]  (value not drawn)
J14  68714014022  [68714014022]
JMP2  DNP  [3M_Twinax_SL8801/12-10DA5-00]
JMP4  DNP  [3M_Twinax_SL8801/12-10DA5-00]

### Sub-sheets
Thermal_MGT = Thermal_MGT.SchDoc: I2C (harness I2C), MGT (harness THERM_MGT)
U_clocking = clocking.SchDoc: SMA_CLKA_P (out), SMA_CLKA_N (out), SMA_CLKB_P (out), SMA_CLKB_N (out), FCLK_N (out), FCLK_P (out)
U_CPU = CPU_ETH.SchDoc: I2C0 (harness I2C), MGT (harness THERM_MGT), EN_AMC_MP (out), EN_AMC_PWR (out), MPS0# (bidir), MPS1# (bidir), MENABLE# (bidir), SW[2..0] (bidir), I2C_RESETN (out), USB_UP (harness USB), USB_UART_Tx (in), USB_UART_Rx (out), SOM_JTAG (harness JTAG), JTAG_SEL (out), INT (bidir)
U_I2C_SW = I2C_SW.SchDoc: I2C_RESETn (in), I2CE (harness I2C), I2CB (harness I2C), I2CA (harness I2C), I2CD (harness I2C), I2CC (harness I2C), I2CG (harness I2C), I2CF (harness I2C), I2CH (harness I2C), I2C_IN (harness I2C), I2C_USB
U_IO = IO.SchDoc: LVDS3_N (bidir), LVDS3_P (bidir), LVDS2_N (bidir), LVDS2_P (bidir), LVDS1_N (bidir), LVDS1_P (bidir), LVDS0_N (bidir), LVDS0_P (bidir)
U_IO = IO.SchDoc: LVDS3_N (bidir), LVDS3_P (bidir), LVDS2_N (bidir), LVDS2_P (bidir), LVDS1_N (bidir), LVDS1_P (bidir), LVDS0_N (bidir), LVDS0_P (bidir)
U_JTAG_AMC_Box = JTAG_AMC_Box.SchDoc: AMC_JTAG (bidir, harness JTAG), SOM_JTAG (bidir, harness JTAG), USB1 (harness USB), USB2 (harness USB), USB3 (harness USB), JTAG_SEL (in)
U_LCD = LCD.SchDoc: I2C, SW[2..0] (bidir)
U_QSFP0 = QSFP.SchDoc: I2C (harness I2C), INT (bidir)
U_QSFP1 = QSFP.SchDoc: I2C (harness I2C), INT (bidir)
U_QSFP2 = QSFP.SchDoc: I2C (harness I2C), INT (bidir)
U_SFP = SFP.SchDoc: I2C (harness I2C), SFP (harness 1xLane), INT (bidir)
U_SFP = SFP.SchDoc: I2C (harness I2C), SFP (harness 1xLane), INT (bidir)
U_Supply = Supply.SchDoc: AMC_PWR (out), EN_AMC_MP (in), EN_AMC_PWR (in)
U_USB_Hub_AMCbox = USB_Hub_AMCbox.SchDoc: USB1 (harness USB), USB2 (harness USB), USB3 (harness USB), USB4 (harness USB), USB_UP (harness USB)
U_USB_I2C_Bridge = USB_I2C_Bridge.SchDoc: I2C_USB (harness I2C), USB (harness USB)
U_USB_UART = USB_UART.SchDoc: USB_UART_Rx (in), USB_UART_Tx (out)

### Harnesses
1xLane: Rx_P, Rx_N, Tx_P, Tx_N
I2C: SCL, SDA
JTAG: TCK, TMS, TDI, TDO, TRST#

### Nets
AMC_MP: JMP4.9(SB5)
GND: B12.1 Cage2.1(CAGE) Cage2.2(CAGE) Cage2.3(CAGE) Cage2.4(CAGE) Cage2.5(CAGE) Cage2.6(CAGE) Cage2.7(CAGE) Cage2.8(CAGE) Cage2.9(CAGE) Cage2.10(CAGE) Cage2.11(CAGE) Cage2.12(CAGE) Cage2.13(CAGE) Cage2.14(CAGE) Cage2.15(CAGE) Cage2.16(CAGE) Cage2.17(CAGE) Cage2.18(CAGE) Cage2.19(CAGE) Cage2.20(CAGE) Cage2.21(CAGE) Cage2.22(CAGE) Cage2.23(CAGE) Cage2.24(CAGE) Cage2.25(CAGE) J14.1 J14.2 J14.3 J14.6 J14.7 J14.10 J14.11 J14.14 J14.15 J14.18 J14.19 J14.22 J14.23 J14.26 J14.27 J14.30 J14.31 J14.34 J14.35 J14.37 J14.38 J14.39 J14.40 JMP2.1(GND) JMP2.14(GND) JMP4.1(GND) JMP4.14(GND)
AMC_PWR: B11.1 ; sheet U_Supply/AMC_PWR
CON_TCK: JMP2.9(SB5) ; sheet U_JTAG_AMC_Box/AMC_JTAG.TCK
CON_TDI: JMP2.8(SB4) ; sheet U_JTAG_AMC_Box/AMC_JTAG.TDI
CON_TDO: JMP2.7(SB3) ; sheet U_JTAG_AMC_Box/AMC_JTAG.TDO
CON_TMS: JMP2.6(SB7) ; sheet U_JTAG_AMC_Box/AMC_JTAG.TMS
CON_TRST#: J14.36 ; sheet U_JTAG_AMC_Box/AMC_JTAG.TRST#
EN_AMC_MP: sheet U_Supply/EN_AMC_MP, sheet U_CPU/EN_AMC_MP
EN_AMC_PWR: sheet U_Supply/EN_AMC_PWR, sheet U_CPU/EN_AMC_PWR
FCLK_N: JMP4.4(Pair1+) ; sheet U_clocking/FCLK_N
FCLK_P: JMP4.5(Pair1-) ; sheet U_clocking/FCLK_P
I2C_RESETn: sheet U_I2C_SW/I2C_RESETn, sheet U_CPU/I2C_RESETN
LVDS0_N: J14.32 ; sheet U_IO/LVDS0_N
LVDS0_P: J14.33 ; sheet U_IO/LVDS0_P
LVDS1_N: J14.28 ; sheet U_IO/LVDS1_N
LVDS1_P: J14.29 ; sheet U_IO/LVDS1_P
LVDS2_N: J14.24 ; sheet U_IO/LVDS2_N
LVDS2_P: J14.25 ; sheet U_IO/LVDS2_P
LVDS3_N: J14.20 ; sheet U_IO/LVDS3_N
LVDS3_P: J14.21 ; sheet U_IO/LVDS3_P
LVDS4_N: J14.16 ; sheet U_IO/LVDS0_N
LVDS4_P: J14.17 ; sheet U_IO/LVDS0_P
LVDS5_N: J14.12 ; sheet U_IO/LVDS1_N
LVDS5_P: J14.13 ; sheet U_IO/LVDS1_P
LVDS6_N: J14.8 ; sheet U_IO/LVDS2_N
LVDS6_P: J14.9 ; sheet U_IO/LVDS2_P
LVDS7_N: J14.4 ; sheet U_IO/LVDS3_N
LVDS7_P: J14.5 ; sheet U_IO/LVDS3_P
MENABLE#: JMP4.6(SB7) ; sheet U_CPU/MENABLE#
MPS0#: JMP4.8(SB4) ; sheet U_CPU/MPS0#
MPS1#: JMP4.7(SB3) ; sheet U_CPU/MPS1#
MSCL_L: JMP4.3(Pair0-) ; sheet U_I2C_SW/I2CD.SCL
MSDA_L: JMP4.2(Pair0+) ; sheet U_I2C_SW/I2CD.SDA
SFP1_Rx0_N: JMP2.10(Pair2+) ; sheet U_SFP/SFP.Rx_N
SFP1_Rx0_P: JMP2.11(Pair2-) ; sheet U_SFP/SFP.Rx_P
SFP1_Tx0_N: JMP2.13(Pair3-) ; sheet U_SFP/SFP.Tx_N
SFP1_Tx0_P: JMP2.12(Pair3+) ; sheet U_SFP/SFP.Tx_P
SFP2_Rx1_N: JMP2.2(Pair0+) ; sheet U_SFP/SFP.Rx_N
SFP2_Rx1_P: JMP2.3(Pair0-) ; sheet U_SFP/SFP.Rx_P
SFP2_Tx1_N: JMP2.5(Pair1-) ; sheet U_SFP/SFP.Tx_N
SFP2_Tx1_P: JMP2.4(Pair1+) ; sheet U_SFP/SFP.Tx_P
SMA_CLKA_N: JMP4.12(Pair3+) ; sheet U_clocking/SMA_CLKA_N
SMA_CLKA_P: JMP4.13(Pair3-) ; sheet U_clocking/SMA_CLKA_P
SMA_CLKB_N: JMP4.10(Pair2+) ; sheet U_clocking/SMA_CLKB_N
SMA_CLKB_P: JMP4.11(Pair2-) ; sheet U_clocking/SMA_CLKB_P
(unnamed): sheet U_SFP/INT, sheet U_SFP/INT, sheet U_CPU/INT, sheet U_QSFP0/INT, sheet U_QSFP1/INT, sheet U_QSFP2/INT
(unnamed): sheet U_CPU/USB_UART_Tx, sheet U_USB_UART/USB_UART_Tx
(unnamed): sheet U_CPU/USB_UART_Rx, sheet U_USB_UART/USB_UART_Rx
(unnamed): sheet U_CPU/JTAG_SEL, sheet U_JTAG_AMC_Box/JTAG_SEL

### Buses and harness runs
bus sheet U_CPU/SW[2..0] = sheet U_LCD/SW[2..0]
harness sheet Thermal_MGT/I2C = sheet U_I2C_SW/I2CH
harness sheet Thermal_MGT/MGT = sheet U_CPU/MGT
harness sheet U_CPU/I2C0 = sheet U_I2C_SW/I2C_IN
harness sheet U_CPU/SOM_JTAG = sheet U_JTAG_AMC_Box/SOM_JTAG
harness sheet U_CPU/USB_UP = sheet U_USB_Hub_AMCbox/USB_UP
harness sheet U_I2C_SW/I2C_USB = sheet U_USB_I2C_Bridge/I2C_USB
harness sheet U_I2C_SW/I2CA = sheet U_SFP/I2C
harness sheet U_I2C_SW/I2CB = sheet U_SFP/I2C
harness sheet U_I2C_SW/I2CC = sheet U_QSFP0/I2C
harness sheet U_I2C_SW/I2CE = sheet U_QSFP2/I2C
harness sheet U_I2C_SW/I2CF = sheet U_LCD/I2C
harness sheet U_I2C_SW/I2CG = sheet U_QSFP1/I2C
harness sheet U_JTAG_AMC_Box/USB1 = sheet U_USB_Hub_AMCbox/USB1
harness sheet U_JTAG_AMC_Box/USB2 = sheet U_USB_Hub_AMCbox/USB2
harness sheet U_JTAG_AMC_Box/USB3 = sheet U_USB_Hub_AMCbox/USB3
harness sheet U_USB_Hub_AMCbox/USB4 = sheet U_USB_I2C_Bridge/USB

### Layout directives
differential pair: LVDS0_N, LVDS0_P, LVDS1_N, LVDS1_P, LVDS2_N, LVDS2_P, LVDS3_N, LVDS3_P, LVDS4_N, LVDS4_P, LVDS5_N, LVDS5_P, LVDS6_N, LVDS6_P, LVDS7_N, LVDS7_P, SFP1_Rx0_N, SFP1_Rx0_P, SFP1_Tx0_N, SFP1_Tx0_P, SFP2_Rx1_N, SFP2_Rx1_P, SFP2_Tx1_N, SFP2_Tx1_P, SMA_CLKA_N, SMA_CLKA_P, SMA_CLKB_N, SMA_CLKB_P
net class SFP: SFP1_Rx0_N, SFP1_Rx0_P, SFP1_Tx0_N, SFP1_Tx0_P, SFP2_Rx1_N, SFP2_Rx1_P, SFP2_Tx1_N, SFP2_Tx1_P
net class DE: SFP1_Rx0_N, SFP1_Rx0_P, SFP1_Tx0_N, SFP1_Tx0_P, SFP2_Rx1_N, SFP2_Rx1_P, SFP2_Tx1_N, SFP2_Tx1_P

### Notes on the sheet
- TOP CONTACT
- PANEL-SIDE MOUNTING HOLES
- Project/Equipment
- Document
- Designer
- Drawn by
- Check.by
- Copyright WUT ISE 2020.
  This documentation describes Open Hardware and is licensed under the CERN OHL v.1.2. You may redistribute and modify this documentation under the terms of the CERN OHL v.1.2. (http://ohwr.org/CERNOHL). This documentation is distributed WITHOUT ANY EXPRESS OR IMPLIED WARRANTY, INCLUDING OF MERCHANTABILITY, SATISFACTORY QUALITY AND FITNESS FOR A PARTICULAR PURPOSE. Please see the CERN OHL v.1.2 for applicable conditions.
- Contact
- File
- Last Mod.
- Print Date
- Sheet
- Size
- A3
- of
- Rev

### Library data of the parts
B11 B12 = PLATED_HOLE1.5_PAD2.0: as B9 on sheet AMC_BOX_Backplane; Part Number: PLATED_HOLE1.5_PAD2.0; Component Kind: Standard (No BOM); Component Type: Standard (No BOM); Pin Count: 1; Family: Plated Hole; Socket: No; SMD: No; Sense: No; Status: None; ComponentHeight: 0mm; HelpURL: Undefined; Author: CERN DEM JLC; CreateDate: 30.10.2008; LatestRevisionDate: 30.10.2008; PackageDescription: Plated Through Hole: Hole Dia.=1.5mm Pad Dia.=2.0mm, IPC-7251 Level C
Cage2 = TYCO_2007263-1: SFP 1x2 Cage (25Pins); Part Description: 1x2 Press Fit SFP+ Cage with EMI Springs; Manufacturer: TYCO ELECTRONICS; Part Number: TYCO_2007263-1; Component Kind: Standard; Component Type: Standard; Pin Count: 25; Family: SFP+; Mounted: Yes; Socket: No; SMD: No; PressFit: Yes; Sense: No; Status: None; Manufacturer Part Number: 2007263-1; ComponentHeight: 9.7mm; HelpURL: \\cern.ch\dfs\Applications\Altium\Datasheets\TYCO_2007263-1.pdf; Author: CERN DEM JLC; CreateDate: 18.01.2017; LatestRevisionDate: 18.01.2017
FTG3 FTG6 = FIDUCIAL_TARGET_S100-200: Fiducial Target; Part Description: Square Fiducial Target, Top Layer, 1.0mm, Top Solder 2.0mm, Keepout =2.0mm; Mounted: No; Part Number: FIDUCIAL_TARGET_S100-200; Component Kind: Standard (No BOM); Component Type: Standard (No BOM); Pin Count: 1; Family: Fiducial; Socket: No; SMD: Yes; Sense: No; Status: None; ComponentHeight: 0mm; HelpURL: Undefined; Author: CERN DEM JLC; CreateDate: 09.02.2010; LatestRevisionDate: 04.04.2012; PackageDescription: Square Fiducial Target, Top Layer, 1.0mm, Top Solder 2.0mm, Keepout =2.0mm
FTG4 FTG8 = FIDUCIAL_TARGET_C100-200: Fiducial Target; Part Description: Round Fiducial Target, Top Layer, 1.0mm, Top Solder 2.0mm, Keepout =2.0mm; Mounted: No; Part Number: FIDUCIAL_TARGET_C100-200; Component Kind: Standard (No BOM); Component Type: Standard (No BOM); Pin Count: 1; Family: Fiducial; Socket: No; SMD: Yes; Sense: No; Status: None; ComponentHeight: 0mm; HelpURL: Undefined; Author: CERN DEM JLC; CreateDate: 09.02.2010; LatestRevisionDate: 04.04.2012; PackageDescription: Round Fiducial Target, Top Layer, 1.0mm, Top Solder 2.0mm, Keepout =2.0mm
J14 = 68714014022: 0.50 mm SMT ZIF Horizontal Top Contact WR-FPC, 40 pins; Pitch: 0.5 mm; Pin Number: 40; ComponentLink1Description: Manufacturer; ComponentLink1URL: http://www.we-online.de; ComponentLink2Description: Datasheet; ComponentLink2URL: http://katalog.we-online.com/em/datasheet/6871xx14022.pdf; Part Number: 68714014022; Published Date: April 2017; Publisher: Wurth Elektronik
JMP2 JMP4 = CBL_TWINAX_3M_4pairs_SB: as JMP1 on sheet AMC_BOX_Backplane